# Altium schematic sheet Power Connectors and Switch.SchDoc
size A4
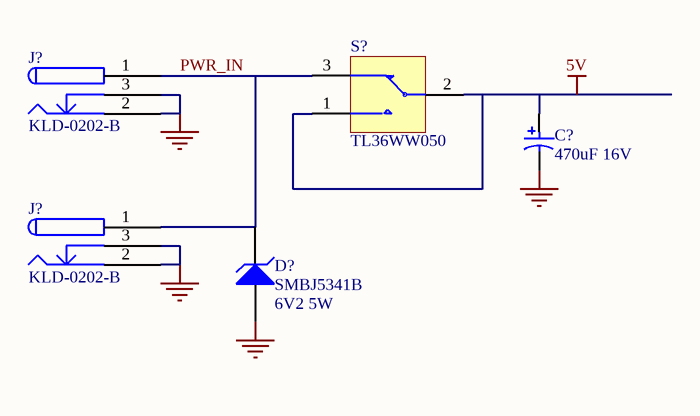
[diagram p0: Power Connectors and Switch.SchDoc]

## Parts
(Parts that share a designator on the sheet are numbered #1, #2 ... from top to bottom, then left to right.)
C?  470uF 16V  [RB8/3.5]
D?  SMBJ5341B  Part Description: 6V2 5W  [DO214]
J?#1  KLD-0202-B  [KLD-0202]
J?#2  KLD-0202-B  [KLD-0202]
S?  TL36WW050  [TL36WW15050]

## Nets
5V: C?.1 S?.1 S?.2
GND: C?.2 D?.1(A) J?#1.2 J?#1.2A J?#1.2B J?#1.3 J?#1.3A J?#1.3B J?#2.2 J?#2.2A J?#2.2B J?#2.3 J?#2.3A J?#2.3B
PWR_IN: D?.2(K) J?#1.1 J?#1.1A J?#1.1B J?#2.1 J?#2.1A J?#2.1B S?.3

## Library data of the parts
C? = CAP_POLAR: Polar Capacitor; Fitted: True
D? = BZG03C13: Zener Diode, 6.2V, 5W; Manufacturer: Microsemi; Fitted: True; Revision: 31-Oct-2003
J?#1 J?#2 = KLD-0202-B: Low Voltage Power Supply Connector; Manufacturer: Kycon; Fitted: True
S? = PCB_MOUNT_SWITCH: SPDT Subminiature Toggle Switch; Fitted: True